# EAGLE design pcb_v1.4 (EAGLE 9.1.1)
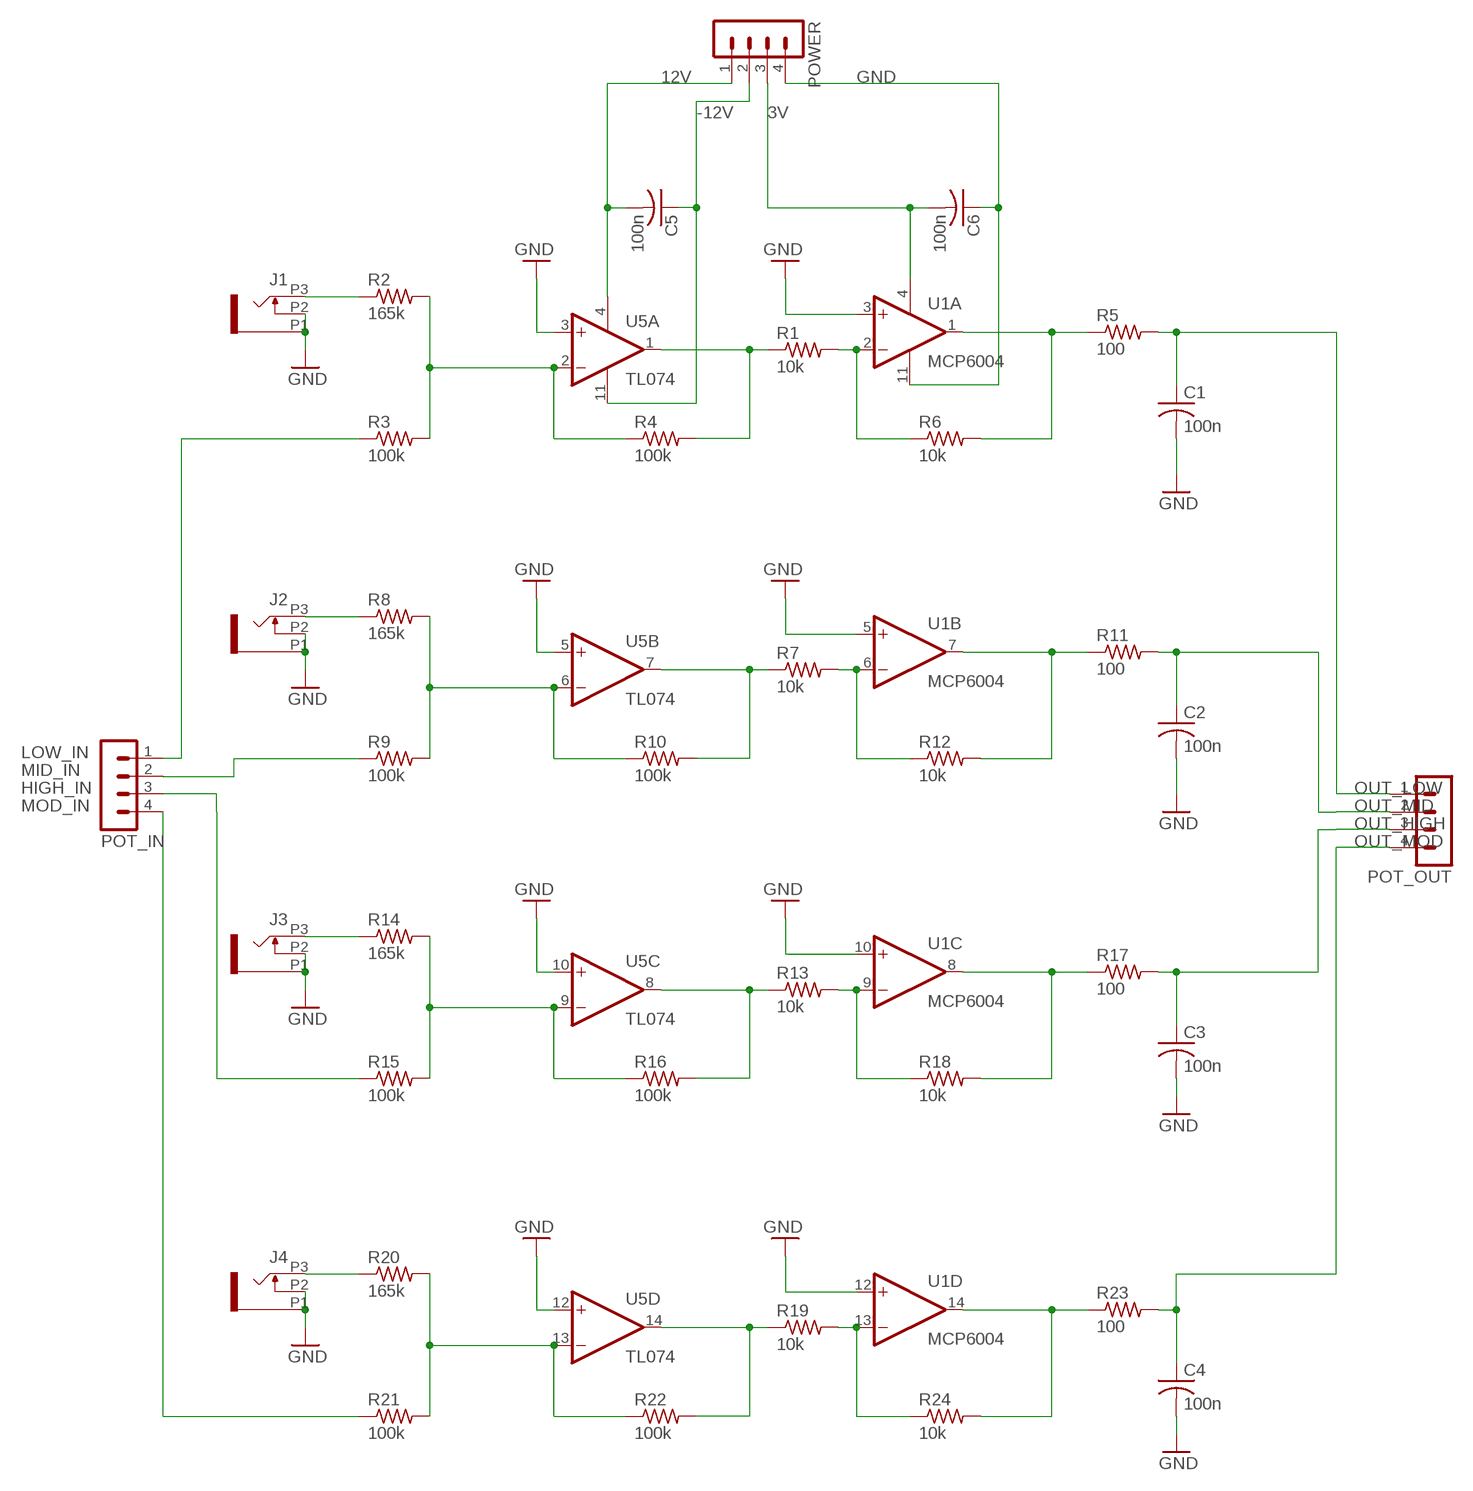
[diagram p0: schematic, sheet 1]

## Parts
C1  100n  C-USC0603  [C0603]
C2  100n  C-USC0603  [C0603]
C3  100n  C-USC0603  [C0603]
C4  100n  C-USC0603  [C0603]
C5  100n  C-USC0603  [C0603]
C6  100n  C-USC0603  [C0603]
J1  PJ301_THONKICONN6  [WQP_PJ_301M6]
J2  PJ301_THONKICONN6  [WQP_PJ_301M6]
J3  PJ301_THONKICONN6  [WQP_PJ_301M6]
J4  PJ301_THONKICONN6  [WQP_PJ_301M6]
POT_IN  MA04-1  [MA04-1]
POT_OUT  MA04-1  [MA04-1]
POWER  MA04-1  [MA04-1]
R1  10k  R-US_R0603  [R0603]
R2  165k  R-US_R0603  [R0603]
R3  100k  R-US_R0603  [R0603]
R4  100k  R-US_R0603  [R0603]
R5  100  R-US_R0603  [R0603]
R6  10k  R-US_R0603  [R0603]
R7  10k  R-US_R0603  [R0603]
R8  165k  R-US_R0603  [R0603]
R9  100k  R-US_R0603  [R0603]
R10  100k  R-US_R0603  [R0603]
R11  100  R-US_R0603  [R0603]
R12  10k  R-US_R0603  [R0603]
R13  10k  R-US_R0603  [R0603]
R14  165k  R-US_R0603  [R0603]
R15  100k  R-US_R0603  [R0603]
R16  100k  R-US_R0603  [R0603]
R17  100  R-US_R0603  [R0603]
R18  10k  R-US_R0603  [R0603]
R19  10k  R-US_R0603  [R0603]
R20  165k  R-US_R0603  [R0603]
R21  100k  R-US_R0603  [R0603]
R22  100k  R-US_R0603  [R0603]
R23  100  R-US_R0603  [R0603]
R24  10k  R-US_R0603  [R0603]
U1  MCP6004  MCP6004_SMD  [SO14]
U5  TL074  TL074_SMD  [SO14]

## Nets
3V: C6.2 POWER.3 U1.4(P:V+)
12V: C5.2 POWER.1 U5.4(P:V+)
-12V: C5.1 POWER.2 U5.11(P:V-)
GND: C1.2 C2.2 C3.2 C4.2 C6.1 J1.P1 J1.P2 J2.P1 J2.P2 J3.P1 J3.P2 J4.P1 J4.P2 POWER.4 U1.3(A:+IN) U1.5(B:+IN) U1.10(C:+IN) U1.11(P:V-) U1.12(D:+IN) U5.3(A:+IN) U5.5(B:+IN) U5.10(C:+IN) U5.12(D:+IN)
HIGH_IN: POT_IN.3 R15.1
LOW_IN: POT_IN.1 R3.1
MID_IN: POT_IN.2 R9.1
MOD_IN: POT_IN.4 R21.1
N$1: J1.P3 R2.1
N$3: R2.2 R3.2 R4.1 U5.2(A:-IN)
N$4: R1.1 R4.2 U5.1(A:OUT)
N$5: R5.1 R6.2 U1.1(A:OUT)
N$6: J2.P3 R8.1
N$8: R8.2 R9.2 R10.1 U5.6(B:-IN)
N$9: R7.1 R10.2 U5.7(B:OUT)
N$11: J3.P3 R14.1
N$13: R14.2 R15.2 R16.1 U5.9(C:-IN)
N$14: R13.1 R16.2 U5.8(C:OUT)
N$16: J4.P3 R20.1
N$18: R20.2 R21.2 R22.1 U5.13(D:-IN)
N$19: R19.1 R22.2 U5.14(D:OUT)
N$20: R1.2 R6.1 U1.2(A:-IN)
N$22: R7.2 R12.1 U1.6(B:-IN)
N$23: R13.2 R18.1 U1.9(C:-IN)
N$24: R19.2 R24.1 U1.13(D:-IN)
N$26: R11.1 R12.2 U1.7(B:OUT)
N$27: R17.1 R18.2 U1.8(C:OUT)
N$28: R23.1 R24.2 U1.14(D:OUT)
OUT_HIGH: C3.1 POT_OUT.3 R17.2
OUT_LOW: C1.1 POT_OUT.1 R5.2
OUT_MID: C2.1 POT_OUT.2 R11.2
OUT_MOD: C4.1 POT_OUT.4 R23.2

## Library data of the parts
C1-C6 = rcl:C-US: CAPACITOR, American symbol; SPICEPREFIX: C
J1-J4 = og-pj301:PJ301_THONKICONN; SPICEPREFIX: J
POT_IN POT_OUT POWER = con-lstb:MA04-1: PIN HEADER; OC_FARNELL: unknown; OC_NEWARK: unknown
R1-R24 = rcl:R-US_: RESISTOR, American symbol; SPICEPREFIX: R
U1 = MusicThingModular:MCP6004: Generic Quad Op Amp
U5 = MusicThingModular:TL074: Generic Quad Op Amp

## Board
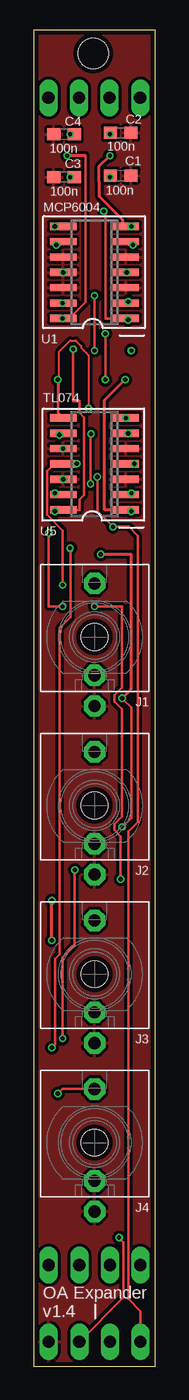
[diagram p1: board, top side]
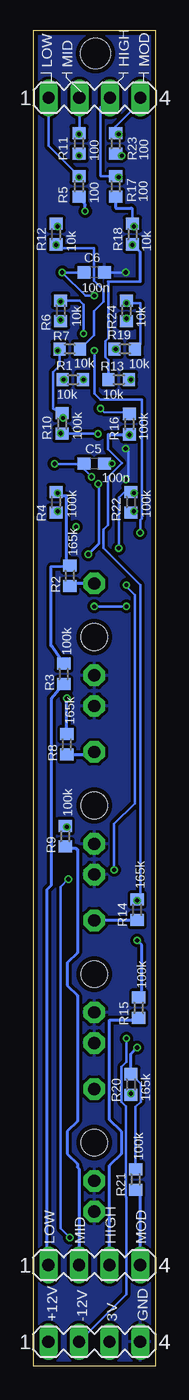
[diagram p2: board, bottom side, seen from below]

Size 10.13 x 110.76 mm. Coordinates in mm from the lower left corner, seen from the top.
Outline: 0,0 10.13,0 10.13,110.76 0,110.76 0,0
Copper layers (1*16): Top 0.035559375mm / dielectric 1.6mm / Bottom 0.035559375mm
Design rules "oshpark-2layer *": minimum track width 6mil, minimum drill 10mil, track to track 6mil, track to pad 6mil, pad to pad 6mil, via to via 6mil, smd to smd 0mil, copper to edge 15mil, drill to drill 10mil, minimum pad ring 5mil, minimum via ring 5mil, stop-mask expansion 2.5mil, vias tented up to drill 0mil, thermal gap 10mil
Holes 2.5 mm at 4.98,108.81

### Footprints (pad centres in the part's own frame; a part is rotated, then mirrored left to right if it is on the bottom)
C0603 = smd 1.1 x 1: 1 -0.85,0; 2 0.85,0
WQP_PJ_301M6 = drill 1.016 pad 1.778 octagon: P1 0,-5.715; P2 0,-3.175; P3 0,4.445 | hole 2.2: 0,0
MA04-1 = drill 1.016 long: 1 -3.81,0; 2 -1.27,0; 3 1.27,0; 4 3.81,0
R0603 = smd 1 x 1.1: 1 -0.85,0; 2 0.85,0
SO14 = smd 0.6 x 2.2: 1 -3.81,-2.6; 2 -2.54,-2.6; 3 -1.27,-2.6; 4 0,-2.6; 5 1.27,-2.6; 6 2.54,-2.6; 7 3.81,-2.6; 8 3.81,2.6; 9 2.54,2.6; 10 1.27,2.6; 11 0,2.6; 12 -1.27,2.6; 13 -2.54,2.6; 14 -3.81,2.6

### Placement (x,y rotation side)
C1  7.24,98.7 0 top
C2  7.24,102.26 0 top
C3  2.54,98.58 180 top
C4  2.54,102.13 180 top
C5  5.08,74.83 180 bottom
C6  5.08,90.68 180 bottom
J1  5.08,60.45 0 top
J2  5.08,46.48 0 top
J3  5.08,32.51 0 top
J4  5.08,18.54 0 top
POT_IN  5.08,8.38 0 bottom
POT_OUT  5.05,105.16 0 bottom
POWER  5.08,2.03 0 bottom
R1  6.86,81.79 0 bottom
R2  7.11,65.53 90 bottom
R3  7.62,57.4 90 bottom
R4  8.26,71.63 270 bottom
R5  6.35,97.82 90 bottom
R6  7.87,87.5 270 bottom
R7  7.11,84.33 0 bottom
R8  7.37,51.56 90 bottom
R9  7.49,43.94 90 bottom
R10  7.75,78.16 90 bottom
R11  6.35,101.37 90 bottom
R12  8.26,93.85 90 bottom
R13  3.05,81.79 180 bottom
R14  1.52,37.85 90 bottom
R15  1.4,29.72 90 bottom
R16  2.16,78.11 90 bottom
R17  3.3,97.82 90 bottom
R18  1.91,93.85 90 bottom
R19  2.54,84.33 0 bottom
R20  2.03,23.37 90 bottom
R21  1.65,15.49 90 bottom
R22  2.03,71.63 270 bottom
R23  3.3,101.37 90 bottom
R24  2.41,87.5 270 bottom
U1  5.08,90.68 90 top
U5  5.08,74.8 90 top

### Tracks (layer width: path | path; a pad name or v marks a point on that pad's centre or on a via)
3V  (via drill 0.35)
  Top 0.152: v7.75,90.68 U1.4
  Top 0.203: POWER.3 7.49,5.71 7.49,10.29 v7.11,10.67 | v7.24,40.39 7.24,43.94 6.73,44.44 6.73,44.97 7.37,45.6 7.37,54.48 6.73,55.11 6.73,55.63 7.37,56.27 7.37,62.99 v5.08,62.99 | v2.41,62.99 1.27,62.99 v1.27,69.09 | v5.08,84.2 v5.08,88.75
  Bottom 0.152: v2.41,62.99 2.44,62.94 2.59,62.94 2.59,62.99
  Bottom 0.203: v7.11,10.67 7.87,11.43 7.87,39.75 v7.24,40.39 | v5.08,62.99 2.59,62.99 | v1.27,69.09 1.27,70.13 1.12,70.28 1.12,80.14 4.57,80.14 5.08,80.64 v5.08,84.2 | v5.08,88.75 5.82,88.75 v7.75,90.68 C6.2
12V  (via drill 0.35)
  Top 0.152: U5.4 7.77,74.83 8.38,74.83 v8.38,74.8
  Top 0.203: POWER.1 8.89,4.57 7.87,5.59 7.87,44.32 8.68,45.13 8.68,68.83 7.92,69.6 v6.6,69.6 5.31,70.89 v5.31,73.74
  Bottom 0.203: v5.31,73.74 6.38,74.8 5.96,74.8 | 5.96,74.8 C5.2 5.96,74.8 | v8.38,74.8 5.96,74.8
-12V  (via drill 0.35)
  Top 0.152: U5.11 2.44,74.83 1.83,74.83 1.79,74.86
  Top 0.203: v3.43,41.15 3.43,34.92 2.41,33.91 v2.41,27.18 | 1.79,74.86 1.13,74.19 1.13,70.59 2.42,69.3 v2.42,64.77 v2.41,64.77 | U5.11 3.58,74.8 v3.61,74.83
  Bottom 0.203: POWER.2 2.41,5.97 2.41,14 2.46,14.04 2.46,21.53 2.84,21.91 2.84,24.82 2.41,25.25 v2.41,27.18 | v3.43,41.15 3.43,44.96 1.72,46.67 1.72,63.95 2.41,64.64 v2.41,64.77 | C5.1 v3.61,74.83
GND  (via drill 0.35)
  Top 0.152: U5.12 2.44,73.61 1.83,73.61 1.78,73.66
  Bottom 0.203: C6.1 U1.11 | U5.12 2.23,73.78 2.23,75.84 v2.46,76.07
  other vias: 2.48,90.68 2.48,73.53
  pour Top (isolate 0.254): 0,110.74 10.16,110.74 10.16,0 0,0
  pour Bottom (isolate 0.254): -0.13,0 10.16,0 10.16,110.74 -0.13,110.74
HIGH_IN
  Bottom 0.229: 3.81,20.44 3.81,28.7 1.56,28.7
  Bottom 0.254: POT_IN.3 3.81,16.64 2.84,17.61 2.84,19.47 3.81,20.44 | 1.56,28.7 arc-90 R15.1
LOW_IN
  Bottom 0.152: 9.04,8.38 POT_IN.1
  Bottom 0.254: R3.1 8.64,55.37 8.66,55.35 8.66,39.88 9.04,39.5 9.04,8.38
MID_IN
  Bottom 0.254: R9.1 arc-90 7.33,42.93 6.6,42.93 arc90 6.48,42.8 6.48,34.29 7.32,33.44 7.32,31.58 6.48,30.74 6.48,20.32 7.32,19.47 7.32,17.61 6.48,16.77 6.48,16.51 6.35,16.38 POT_IN.2
MOD_IN
  Bottom 0.254: POT_IN.4 1.27,14.26 arc-90 R21.1
N$1
  Bottom 0.254: J1.P3 6.9,64.9 arc-90 R2.1
N$3  (via drill 0.35)
  Top 0.152: v8.13,72.39 7.77,72.39 U5.2
  Bottom 0.152: v8.13,72.39 8.23,72.39 R4.1
  Bottom 0.203: 8.66,66.29 7.2,66.29 R2.2
  Bottom 0.254: R4.1 arc-90 7.91,72.14 7.37,72.14 7.37,66.64 R2.2 | R3.2 8.64,59.69 8.66,59.71 8.66,66.29
N$4  (via drill 0.35)
  Top 0.152: v8.13,70.87 7.77,70.87 U5.1
  Top 0.254: U5.1 5.92,70.99 5.92,80.09 v7.62,81.79
  Bottom 0.152: v8.13,70.87 8.23,70.87 R4.2 | v7.62,81.79 7.62,81.84 R1.1
N$5  (via drill 0.35)
  Top 0.152: v7.87,86.74 7.77,86.87 U1.1
  Top 0.203: U1.1 5.97,86.87 5.97,90.68 5.97,95.63 v5.84,95.76
  Bottom 0.152: v7.87,86.74 7.92,86.72 R6.2
  Bottom 0.254: R5.1 5.84,96.29 v5.84,95.76
N$6
  Bottom 0.152: 5.6,50.71 5.49,50.75 5.18,51.05 J2.P3
  Bottom 0.254: R8.1 5.6,50.71
N$8  (via drill 0.35)
  Top 0.152: v7.87,77.34 7.77,77.42 U5.6
  Top 0.203: v7.37,55.37 8.13,54.61 8.13,45.47 v7.37,44.7 | v4.75,73.15 4.75,77.28 v4.78,77.31
  Top 0.254: v7.37,55.37 8.13,56.13 8.13,67.31 v5.59,67.31
  Bottom 0.152: R9.2 7.47,44.81 v7.37,44.7 | R10.1 7.76,77.34 v7.87,77.34
  Bottom 0.203: R10.1 v4.78,77.31 | 4.7,68.2 4.7,73.11 v4.75,73.15
  Bottom 0.254: R8.2 v7.37,55.37 | v5.59,67.31 4.7,68.2
N$9  (via drill 0.35)
  Bottom 0.152: v8.13,84.2 8.08,84.28 R7.1
  Bottom 0.203: R7.1 7.96,82.97 8.51,82.42 8.51,79.67 8.51,79.37 | 8.51,79.37 | 8.51,79.37 R10.2 arc90 7.68,78.94 U5.7
  other vias: 7.68,78.61
N$11
  Bottom 0.254: R14.1 1.53,36.96 J3.P3
N$13  (via drill 0.35)
  Top 0.152: U5.9 2.44,77.27 2.29,77.27 v2.16,77.22
  Top 0.254: v1.52,35.31 v1.52,38.61
  Bottom 0.152: v2.16,77.22 2.13,77.27 R16.1 | R14.2 v1.52,38.61
  Bottom 0.203: R14.2 1.27,38.95 1.27,64.77 4.32,67.82 4.32,69.34 3.94,69.72 3.94,73.71 2.79,74.85 2.79,74.88 3.94,76.02 3.94,77.25
  Bottom 0.229: 3.94,77.25 R16.1
  Bottom 0.254: v1.52,35.31 1.14,34.92 1.14,30.82 R15.2
N$14  (via drill 0.35)
  Top 0.152: v4.57,79.4 4.57,83.82 3.96,84.43 3.96,84.58 3.5,85.04 3.05,85.04 2.13,84.12 2.13,81.84 v2.03,81.79
  Top 0.203: 2.03,80.18 2.03,79.06 U5.8
  Top 0.254: v2.03,81.79 2.03,80.18
  Bottom 0.152: v4.57,79.4 4.27,79.1 2.29,79.1 R16.2 | R13.1 2.13,81.84 v2.03,81.79
N$16  (via drill 0.35)
  Top 0.203: J4.P3 2.41,22.99 v2.03,22.61
  Bottom 0.152: R20.1 1.98,22.55 v2.03,22.61
N$18  (via drill 0.35)
  Top 0.152: v1.78,72.39 2.44,72.39 U5.13
  Top 0.203: v3.05,67.82 3.07,67.79 3.07,62.13 2.16,61.21 2.16,34.16 1.78,33.78 1.78,26.67 v1.52,26.42
  Bottom 0.152: R22.1 1.98,72.39 v1.78,72.39 2.13,72.54 2.33,72.73
  Bottom 0.203: 2.33,72.73 3.05,72.01 v3.05,67.82 | R21.2 1.65,21.49 1.23,21.91 1.23,23.41 R20.2
  Bottom 0.254: R20.2 2.03,25.91 v1.52,26.42
N$19  (via drill 0.35)
  Top 0.152: v1.78,70.87 2.44,70.87 U5.14
  Top 0.203: v3.3,84.33 3.3,80.01 3.81,80.01 3.81,79.04 4.19,78.66 4.19,72.21 3.81,71.83 3.81,70.99 2.73,70.99
  Top 0.254: 2.73,70.99 U5.14
  Bottom 0.152: v1.78,70.87 1.98,70.87 R22.2 | v3.3,84.33 3.35,84.43 R19.1
N$20  (via drill 0.35)
  Top 0.152: U1.2 7.77,88.24 v7.87,88.27
  Top 0.203: v5.97,81.79 v5.97,85.6
  Bottom 0.152: v7.87,88.27 7.92,88.39 R6.1 | v5.97,81.79 5.94,81.84 R1.2
  Bottom 0.203: v5.97,85.6 5.97,88.01 6.31,88.35 R6.1
N$22  (via drill 0.35)
  Top 0.152: v8.26,92.96 7.92,92.96 7.77,93.12 U1.6
  Bottom 0.152: v8.26,92.96 8.23,92.96 R12.1
  Bottom 0.203: R7.2 5.11,85.48 5.11,87.45 4.32,88.24 4.32,89.2 5.11,89.99 5.11,92.71 7.96,92.71 R12.1
N$23  (via drill 0.35)
  Top 0.152: v1.91,92.96 2.29,92.96 2.44,93.12 U1.9
  Bottom 0.152: v1.91,92.96 1.98,92.96 R18.1
  Bottom 0.203: R13.2 3.9,83.43 4.14,83.67 4.14,84.98 3.9,85.23 3.9,89.88 3.94,89.92 1.27,89.92
  Bottom 0.229: 1.27,89.92 1.27,92.37 R18.1
N$24  (via drill 0.35)
  Top 0.152: U1.13 2.44,88.09 v2.41,88.14
  Bottom 0.203: R19.2 1.27,84.75 1.27,88.14 v2.41,88.14 R24.1
N$26  (via drill 0.35)
  Top 0.152: U1.7 v8.13,94.49
  Top 0.254: v6.35,100.36 5.46,99.47 5.49,96.96 7.43,95.02 7.43,94.74 U1.7
  Bottom 0.152: v8.13,94.49 8.23,94.49 8.23,94.64 R12.2 | v6.35,100.36 6.4,100.48 R11.1
N$27  (via drill 0.35)
  Top 0.152: U1.8 v1.78,94.49
  Bottom 0.152: v1.78,94.49 1.83,94.49 1.83,94.64 R18.2
  Bottom 0.203: 2.03,96.01 arc90 1.91,95.89 R18.2 arc90 1.78,94.58 v1.78,94.49
  Bottom 0.254: R17.1 3.3,96.01 2.03,96.01
N$28  (via drill 0.35)
  Top 0.152: U1.14 v2.41,86.87 3.04,86.87
  Top 0.203: 4.32,100.36 4.32,88.22 3.04,86.94 3.04,86.87
  Top 0.254: 4.32,100.36 v2.79,100.36
  Bottom 0.152: R23.1 3.2,100.48 2.9,100.48 v2.79,100.36 | R24.2 2.44,86.72 2.44,86.87 v2.41,86.87
OUT_HIGH  (via drill 0.35)
  Top 0.152: v3.05,98.58 3.05,98.65 3.35,98.65 C3.1
  Bottom 0.152: v3.05,98.58 3.05,98.65 3.2,98.65 R17.2
  Bottom 0.203: R17.2 4.53,98.67 4.57,98.7 4.57,104.37 POT_OUT.3
OUT_LOW  (via drill 0.35)
  Top 0.152: v6.35,98.58 6.4,98.65 C1.1
  Bottom 0.152: v6.35,98.58 6.4,98.65 R5.2
  Bottom 0.203: R5.2 8.87,101.18 POT_OUT.1
OUT_MID  (via drill 0.35)
  Top 0.152: v6.35,102.13 6.4,102.16 C2.1
  Bottom 0.152: v6.35,102.13 6.4,102.16 R11.2
  Bottom 0.203: POT_OUT.2 6.33,102.25 R11.2
OUT_MOD  (via drill 0.35)
  Top 0.152: v3.05,102.13 3.05,102.16 3.35,102.16 C4.1
  Bottom 0.152: v3.05,102.13 3.05,102.16 3.2,102.16 R23.2
  Bottom 0.203: R23.2 3.3,102.77 1.25,104.83 POT_OUT.4

### Text on the board
tPlace: OA Expander / v1.4
bPlace: MOD | HIGH | MID | LOW | MOD | HIGH | MID | LOW | GND | 3V | -12V | +12V
tNames: MCP6004 | TL074